# Altium schematic sheet CANSAT_Telemetry_schematic.SchDoc
size A; SheetNumber: 1; SheetTotal: 2
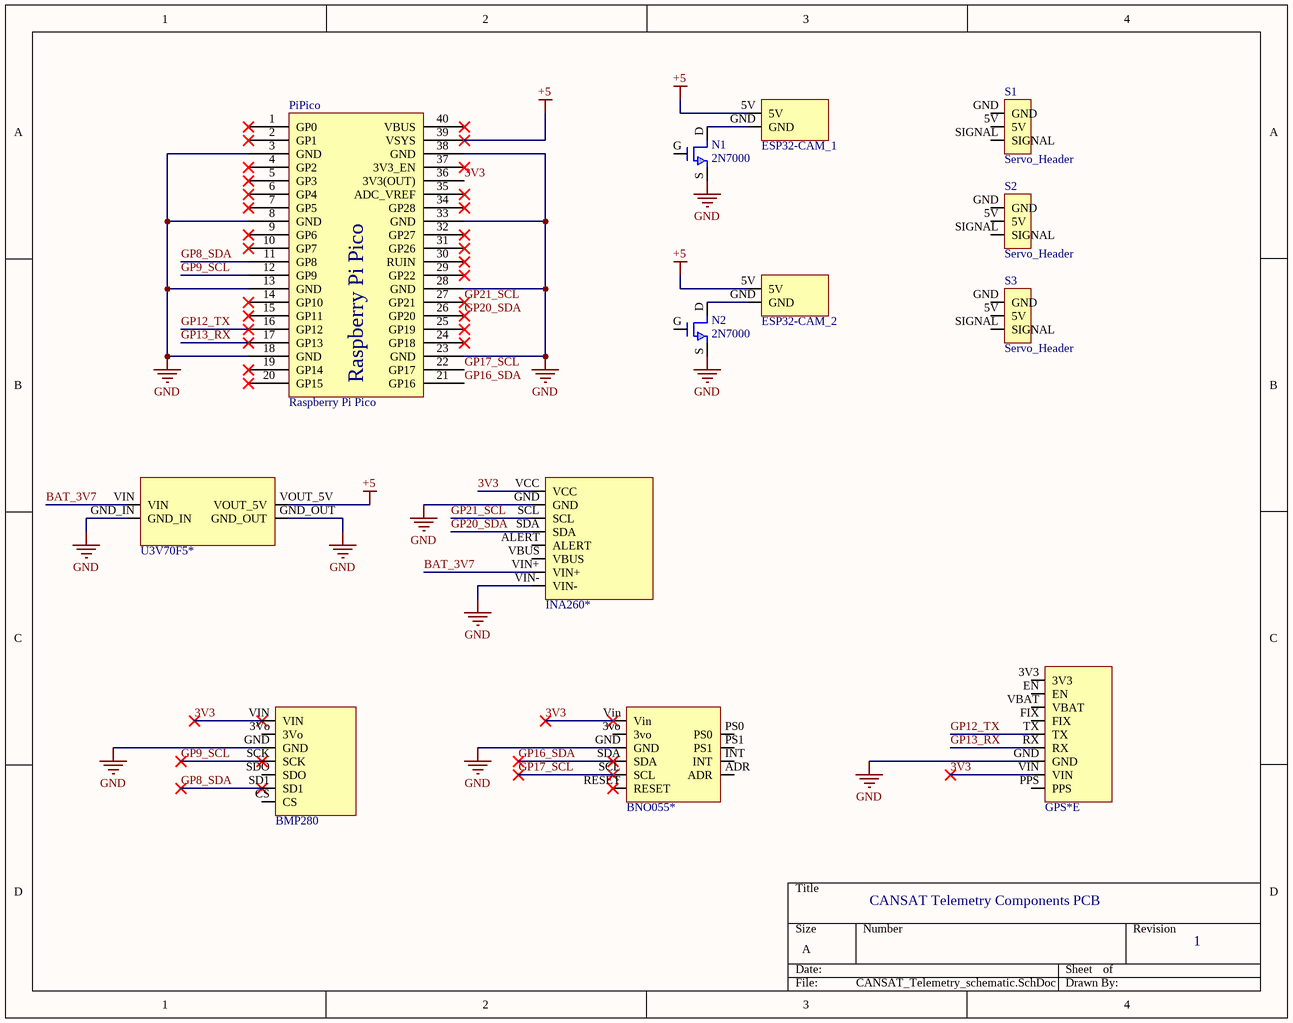
[diagram p0: CANSAT_Telemetry_schematic.SchDoc]

## Parts
BMP280  BMP280  [BMP280_BreakoutBoard]  (value not drawn)
BNO055*  BNO055*  [BNO055_BreakoutBoard]  (value not drawn)
ESP32-CAM_1  ESP32-CAM_1  [ESP32-CAM]  (value not drawn)
ESP32-CAM_2  ESP32-CAM_2  [ESP32-CAM]  (value not drawn)
GPS*  GPS*  [AdafruitUltimateGPS]  (value not drawn)  (part E of 5)
INA260*  INA260*  [INA260_Breakout]  (value not drawn)
N1  2N7000  [2N7000]
N2  2N7000  [2N7000]
PiPico  Raspberry Pi Pico  [Raspberry Pi Pico]
S1  Servo_Header
S2  Servo_Header
S3  Servo_Header
U3V70F5*  U3V70F5*  [U3V70F5]  (value not drawn)

## Nets
+5: ESP32-CAM_1.5V ESP32-CAM_2.5V PiPico.39(VSYS) U3V70F5*.VOUT_5V
GND: BMP280.GND BNO055*.GND GPS*.GND INA260*.GND INA260*.VIN- N1.S N2.S PiPico.3(GND) PiPico.8(GND) PiPico.13(GND) PiPico.18(GND) PiPico.23(GND) PiPico.28(GND) PiPico.33(GND) PiPico.38(GND) U3V70F5*.GND_IN U3V70F5*.GND_OUT
3V3: BMP280.VIN BNO055*.Vin GPS*.VIN INA260*.VCC PiPico.36(3V3(OUT))
BAT_3V7: INA260*.VIN+ U3V70F5*.VIN
GP8_SDA: BMP280.SD1 PiPico.11(GP8)
GP9_SCL: BMP280.SCK PiPico.12(GP9)
GP12_TX: GPS*.TX PiPico.16(GP12)
GP13_RX: GPS*.RX PiPico.17(GP13)
GP16_SDA: BNO055*.SDA PiPico.21(GP16)
GP17_SCL: BNO055*.SCL PiPico.22(GP17)
GP20_SDA: INA260*.SDA PiPico.26(GP20)
GP21_SCL: INA260*.SCL PiPico.27(GP21)
NetESP32-CAM_1_GND: ESP32-CAM_1.GND N1.D
NetESP32-CAM_2_GND: ESP32-CAM_2.GND N2.D

Not connected (* = marked no-connect by the designer): BMP280 3Vo CS SDO; BNO055* 3vo ADR INT PS0 PS1 RESET*; GPS* 3V3 EN FIX PPS VBAT; INA260* ALERT VBUS; N1 G; N2 G; PiPico 1(GP0)* 2(GP1)* 4(GP2)* 5(GP3)* 6(GP4)* 7(GP5)* 9(GP6)* 10(GP7)* 14(GP10)* 15(GP11)* 19(GP14)* 20(GP15)* 24(GP18)* 25(GP19)* 29(GP22)* 30(RUIN)* 31(GP26)* 32(GP27)* 34(GP28)* 35(ADC_VREF)* 37(3V3_EN)* 40(VBUS)*; S1 5V GND SIGNAL; S2 5V GND SIGNAL; S3 5V GND SIGNAL

## Notes on the sheet
- CANSAT Telemetry Components PCB
- 1

## Library data of the parts
BMP280 = BMP280_BreakoutBoard
BNO055* = BNO055
ESP32-CAM_1 ESP32-CAM_2 = ESP32-CAM
GPS* = AdafruitUltimateGPS
INA260* = INA260_Breakout
U3V70F5* = U3V70F5: Boost Regulator: 5V